# Altium schematic sheet Potentiometer and LEDs.SchDoc: 电动汽车电池管理系统
size A4; Address1: 先进成图技术赛道国赛试题; Address2: 陈大勇; Address3: 000000000000000000; Address4: DZ001; SheetNumber: 2; SheetTotal: 5
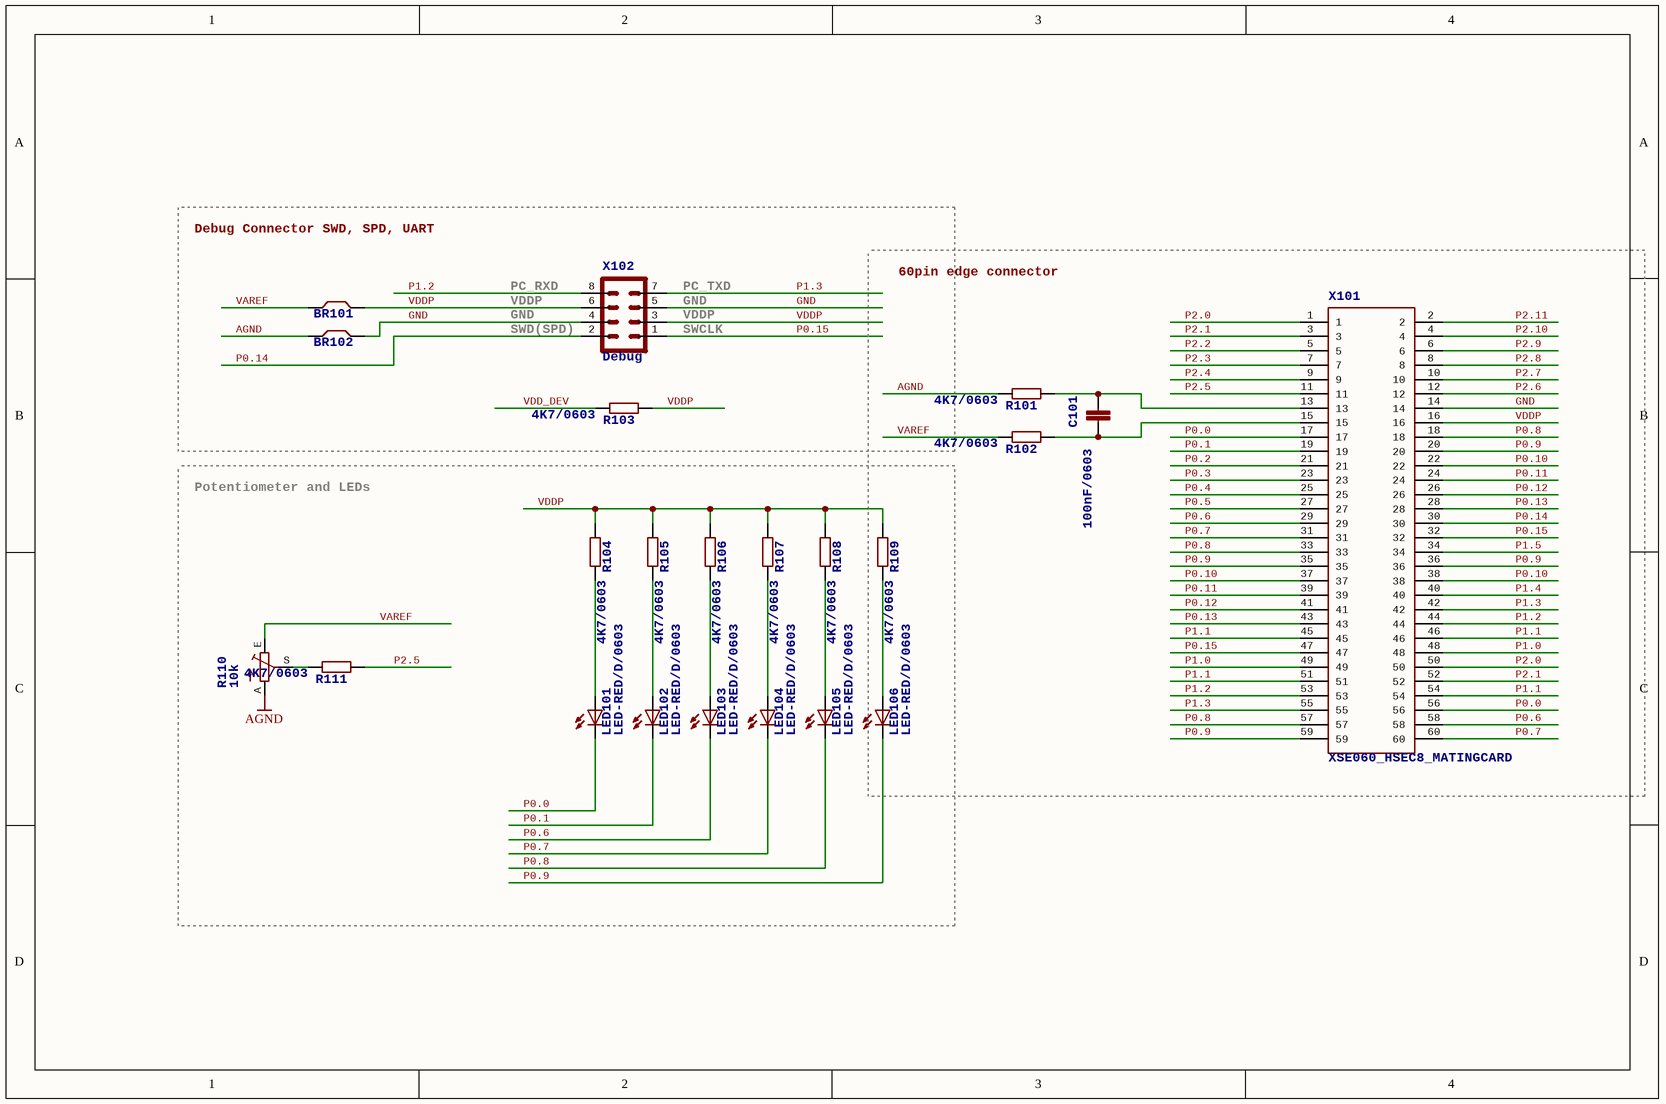
[diagram p0: Potentiometer and LEDs.SchDoc]

## Parts
BR101  BRIDGE12X12  [BRIDGE12]  (value not drawn)
BR102  BRIDGE12X12  [BRIDGE12]  (value not drawn)
C101  100nF/0603  [RCL_C0603]
LED101  LED-RED/D/0603  [LED_CHIP-LED0603]
LED102  LED-RED/D/0603  [LED_CHIP-LED0603]
LED103  LED-RED/D/0603  [LED_CHIP-LED0603]
LED104  LED-RED/D/0603  [LED_CHIP-LED0603]
LED105  LED-RED/D/0603  [LED_CHIP-LED0603]
LED106  LED-RED/D/0603  [LED_CHIP-LED0603]
R101  4K7/0603  [DSR_R0603]
R102  4K7/0603  [DSR_R0603]
R103  4K7/0603  [DSR_R0603]
R104  4K7/0603  [DSR_R0603]
R105  4K7/0603  [DSR_R0603]
R106  4K7/0603  [DSR_R0603]
R107  4K7/0603  [DSR_R0603]
R108  4K7/0603  [DSR_R0603]
R109  4K7/0603  [DSR_R0603]
R110  10k  [B25P]
R111  4K7/0603  [DSR_R0603]
X101  XSE060_HSEC8_MATINGCARD  [XSE060_HSEC8_MATINGCARD_60]
X102  Debug  [MA04-2]

## Blocks framed on the sheet
60pin edge connector: C101 R101 R102 X101
Potentiometer and LEDs: LED101-LED106 R104-R111

## Nets
AGND: BR102.B1 R101.2 R110.A
GND: BR102.B2 X101.14 X102.4 X102.5
P0.0: LED101.C X101.17 X101.56
P0.1: LED102.C X101.19
P0.2: X101.21
P0.3: X101.23
P0.4: X101.25
P0.5: X101.27
P0.6: LED103.C X101.29 X101.58
P0.7: LED104.C X101.31 X101.60
P0.8: LED105.C X101.18 X101.33 X101.57
P0.9: LED106.C X101.20 X101.35 X101.36 X101.59
P0.10: X101.22 X101.37 X101.38
P0.11: X101.24 X101.39
P0.12: X101.26 X101.41
P0.13: X101.28 X101.43
P0.14: X101.30 X102.2
P0.15: X101.32 X101.47 X102.1
P1.0: X101.48 X101.49
P1.1: X101.45 X101.46 X101.51 X101.54
P1.2: X101.44 X101.53 X102.8
P1.3: X101.42 X101.55 X102.7
P1.4: X101.40
P1.5: X101.34
P2.0: X101.1 X101.50
P2.1: X101.3 X101.52
P2.2: X101.5
P2.3: X101.7
P2.4: X101.9
P2.5: R111.1 X101.11
P2.6: X101.12
P2.7: X101.10
P2.8: X101.8
P2.9: X101.6
P2.10: X101.4
P2.11: X101.2
VAREF: BR101.B1 R102.2 R110.E
VDD_DEV: R103.2
VDDP: BR101.B2 R103.1 R104.1 R105.1 R106.1 R107.1 R108.1 R109.1 X101.16 X102.3 X102.6
NetC101_1: C101.1 R101.1 X101.13
NetC101_2: C101.2 R102.1 X101.15
NetLED101_A: LED101.A R104.2
NetLED102_A: LED102.A R105.2
NetLED103_A: LED103.A R106.2
NetLED104_A: LED104.A R107.2
NetLED105_A: LED105.A R108.2
NetLED106_A: LED106.A R109.2
NetR110_S: R110.S R111.2

## Notes on the sheet
- Debug Connector SWD, SPD, UART
- PC_RXD
- VDDP
- GND
- (near X102) SWD(SPD)
- (near X102) PC_TXD
- (near X102) GND
- (near X102) VDDP
- (near X102) SWCLK
- 项目名称
- 选手信息
- 当前日期
- 图页名称
- 当前时间
- 第           幅
- 共           幅

## Library data of the parts
C101 = RCL_C-EUC0603: CAPACITOR, European symbol
LED101-LED106 = LED_LEDCHIP-LED0603: LED   OSRAM: - CHIPLED LG R971, LG N971, LY N971, LG Q971, LY Q971, LO R971, LY R971 LH N974, LH R974 LS Q976, LO Q976, LY Q976 LO Q996 - Hyper CHIPLED LW Q18S LB Q993, LB Q99A, LB R99A - SideLED LS A670, LO A670, LY A670, LG A670, LP A670 LB A673, LV A673, LT A673, LW A673 LH A674 LY A675 LS A676, LA A676, LO A676, LY A676, LW A676 LS A679, LY A679, LG A679 -  Hyper Micro SIDELED® LS Y876, LA Y876, LO Y876, LY Y876 LT Y87S - SmartLED LW L88C, LW L88S LB L89C, LB L89S, LG L890 LS L89K, LO L89K, LY L89K LS L896, LA L896, LO L896, LY L896 - TOPLED LS T670, LO T670, LY T670, LG T670, LP T670 LSG T670, LSP T670, LSY T670, LOP T670, LYG T670 LG T671, LOG T671, LSG T671 LB T673, LV T673, LT T673, LW T673 LH T674 LS T676, LA T676, LO T676, LY T676, LB T676, LH T676, LSB T676, LW T676 LB T67C, LV T67C, LT T67C, LS T67K, LO T67K, LY T67K, LW E67C LS E67B, LA E67B, LO E67B, LY E67B, LB E67C, LV E67C, LT E67C LW T67C LS T679, LY T679, LG T679 LS T770, LO T770, LY T770, LG T770, LP T770 LB T773, LV T773, LT T773, LW T773 LH T774 LS E675, LA E675, LY E675, LS T675 LS T776, LA T776, LO T776, LY T776, LB T776 LHGB T686 LT T68C, LB T68C - Hyper Mini TOPLED® LB M676 - Mini TOPLED Santana® LG M470 LS M47K, LO M47K, LY M47K    Source: http://www.osram.convergy.de   - LUMILED® LXK2-PW12-R00, LXK2-PW12-S00, LXK2-PW14-U00, LXK2-PW14-V00 LXK2-PM12-R00, LXK2-PM12-S00, LXK2-PM14-U00 LXK2-PE12-Q00, LXK2-PE12-R00, LXK2-PE12-S00, LXK2-PE14-T00, LXK2-PE14-U00 LXK2-PB12-K00, LXK2-PB12-L00, LXK2-PB12-M00, LXK2-PB14-N00, LXK2-PB14-P00, LXK2-PB14-Q00 LXK2-PR12-L00, LXK2-PR12-M00, LXK2-PR14-Q00, LXK2-PR14-R00 LXK2-PD12-Q00, LXK2-PD12-R00, LXK2-PD12-S00 LXK2-PH12-R00, LXK2-PH12-S00 LXK2-PL12-P00, LXK2-PL12-Q00, LXK2-PL12-R00    Source: www.luxeon.com
R101-R109 R111 = DSR_R-EU_R0603
R110 = TRIM_EU-B25P: POTENTIOMETER
X102 = MA04-2: PIN HEADER